# EAGLE design attinier84-motherboard-mk-1.0 (EAGLE 6.5.0)
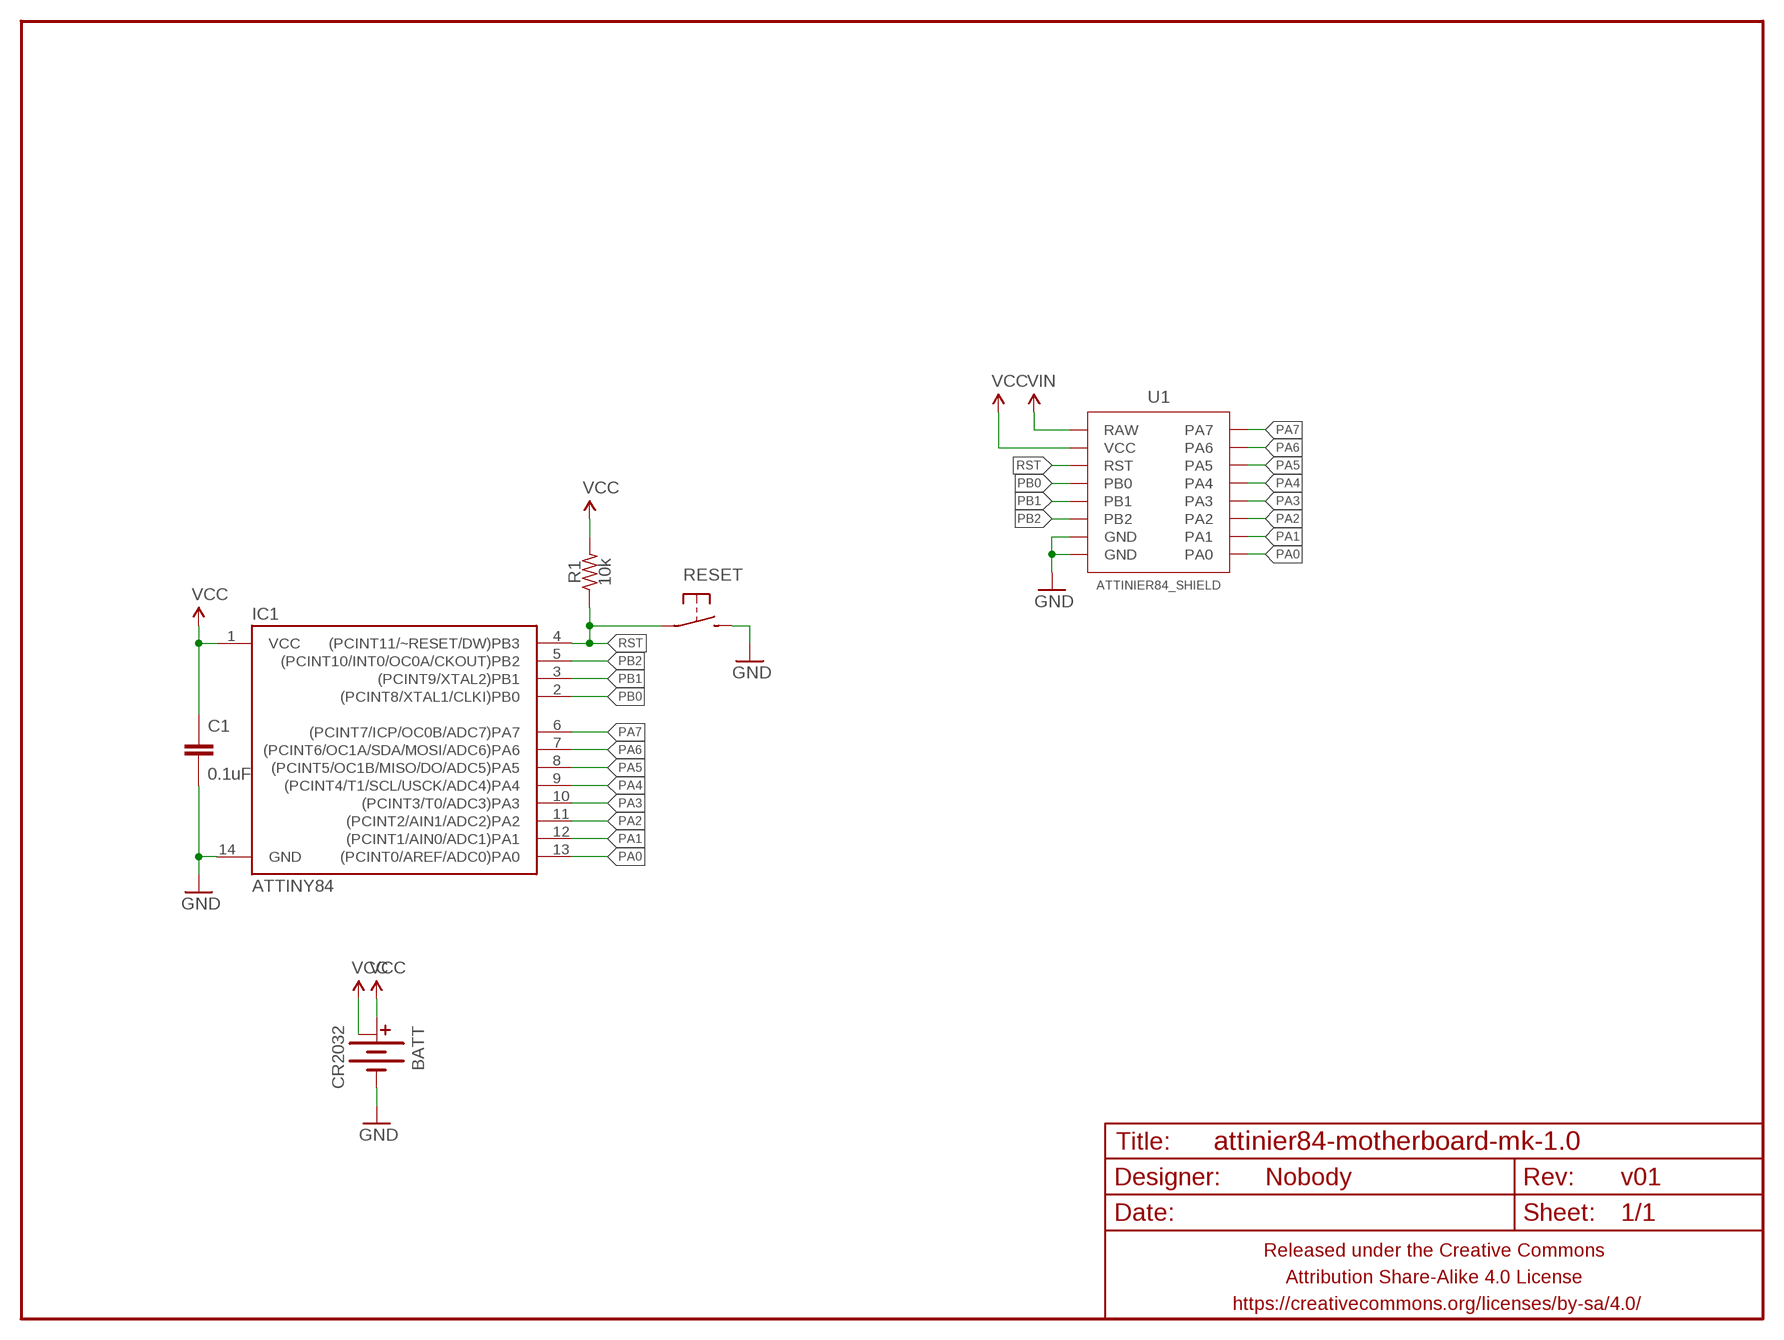
[diagram p0: schematic, sheet 1]

## Parts
BATT  CR2032  BATTERY-COINCR2032_SMD  [BATTCON_20MM_MINE]
C1  0.1uF  CAPACITOR-CERAMICC0805  [C0805]
FRAME1  FRAME-LETTERNO_PACKAGE  [DUMMY]
IC1  ATTINY84  [SO14]
R1  10k  RESISTORR0805  [R0805]
RESET  SPST-NO-TACT6MM-SMD  [DTSM-6]
U1  ATTINIER84_SHIELD  [ATTINIER84_SHIELD]

## Nets
GND: BATT.BOTTOM(-) C1.2 IC1.14(GND) RESET.3 RESET.4 U1.GND@1(GND) U1.GND@2(GND)
PA0: IC1.13((PCINT0/AREF/ADC0)PA0) U1.PA0
PA1: IC1.12((PCINT1/AIN0/ADC1)PA1) U1.PA1
PA2: IC1.11((PCINT2/AIN1/ADC2)PA2) U1.PA2
PA3: IC1.10((PCINT3/T0/ADC3)PA3) U1.PA3
PA4: IC1.9((PCINT4/T1/SCL/USCK/ADC4)PA4) U1.PA4
PA5: IC1.8((PCINT5/OC1B/MISO/DO/ADC5)PA5) U1.PA5
PA6: IC1.7((PCINT6/OC1A/SDA/MOSI/ADC6)PA6) U1.PA6
PA7: IC1.6((PCINT7/ICP/OC0B/ADC7)PA7) U1.PA7
PB0: IC1.2((PCINT8/XTAL1/CLKI)PB0) U1.PB0
PB1: IC1.3((PCINT9/XTAL2)PB1) U1.PB1
PB2: IC1.5((PCINT10/INT0/OC0A/CKOUT)PB2) U1.PB2
RST: IC1.4((PCINT11/~RESET/DW)PB3) R1.1 RESET.1 RESET.2 U1.RST
VCC: BATT.TOP@1(+) BATT.TOP@2(+1) C1.1 IC1.1(VCC) R1.2 U1.VCC
VIN: U1.RAW

## Library data of the parts
BATT = A_butts:BATTERY-COIN
C1 = A_butts:CAPACITOR-CERAMIC: CAPACITOR, European symbol
FRAME1 = A_butts:FRAME-LETTER: Schematic Frame Standard 8.5x11 US Letter frame; DESIGNER: Nobody; VERSION: v01
IC1 = A_butts:ATTINY84: Atmel 14-pin 2/4/8kB flash uC
R1 = A_butts:RESISTOR: RESISTOR, American symbol
RESET = A_butts:SPST-NO-TACT
U1 = A_butts:ATTINIER84_SHIELD

## Board
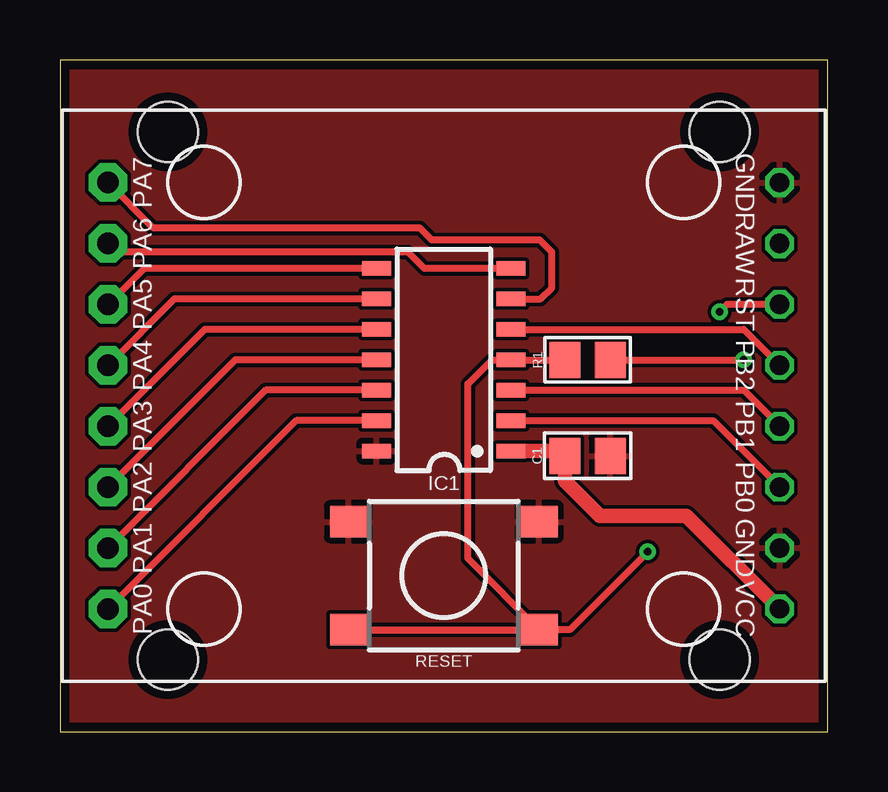
[diagram p1: board, top side]
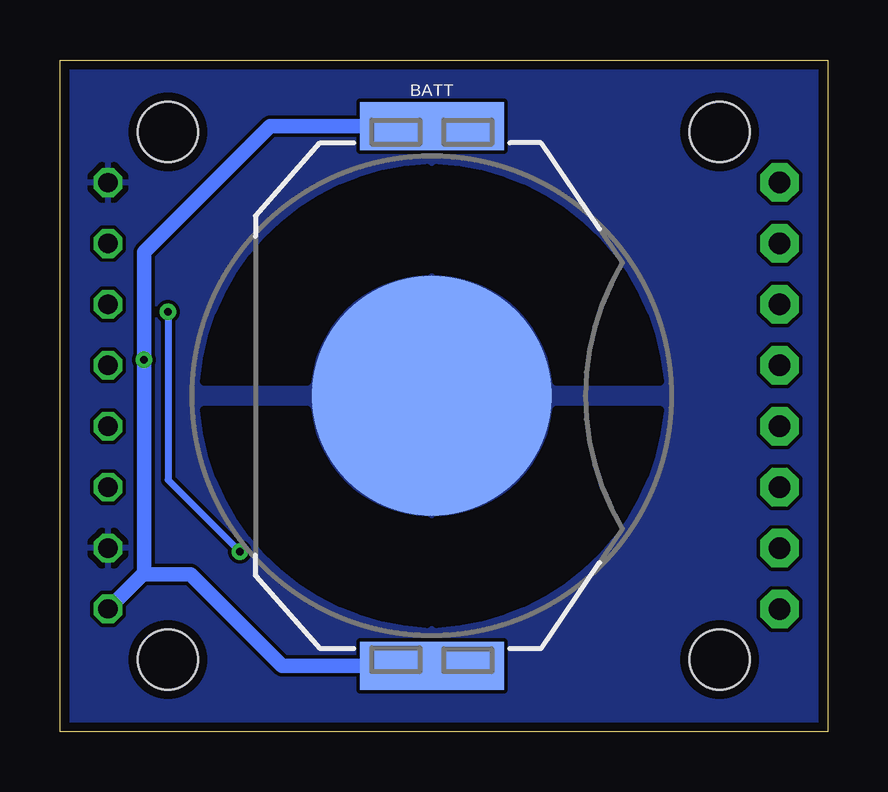
[diagram p2: board, bottom side, seen from below]

Size 32 x 28 mm. Coordinates in mm from the lower left corner, seen from the top.
Outline: 0,0 32,0 32,28 0,28 0,0
Copper layers (1*16): Top 0.0356mm / dielectric 1.5011mm / Bottom 0.0356mm
Design rules "LaenPCBOrder_2": minimum track width 6mil, minimum drill 13mil, track to track 6mil, track to pad 6mil, pad to pad 6mil, via to via 6mil, smd to smd 6mil, copper to edge 15mil, drill to drill 6mil, minimum pad ring 7mil, minimum via ring 7mil, stop-mask expansion 3mil, vias tented up to drill 20mil, thermal gap 10mil
Holes 2.5 mm at 4.5,25 27.5,25 27.5,3 4.5,3

### Footprints (pad centres in the part's own frame; a part is rotated, then mirrored left to right if it is on the bottom)
BATTCON_20MM_MINE = smd 10 x 10: BOTTOM 0,0 | smd 6 x 2: TOP@1 0,11.25; TOP@2 0,-11.25
C0805 = smd 1.3 x 1.5: 1 -0.95,0; 2 0.95,0
SO14 = smd 0.6 x 1.2: 1 -3.81,-2.8; 2 -2.54,-2.8; 3 -1.27,-2.8; 4 0,-2.8; 5 1.27,-2.8; 6 2.54,-2.8; 7 3.81,-2.8; 8 3.81,2.8; 9 2.54,2.8; 10 1.27,2.8; 11 0,2.8; 12 -1.27,2.8; 13 -2.54,2.8; 14 -3.81,2.8
R0805 = smd 1.3 x 1.5: 1 -0.95,0; 2 0.95,0
DTSM-6 = smd 1.55 x 1.3: 1 -3.975,2.25; 2 3.975,2.25; 3 -3.975,-2.25; 4 3.975,-2.25
ATTINIER84_SHIELD = drill 0.8 octagon: GND@1 14,-6.35; GND@2 14,8.89; PB0 14,-3.81; PB1 14,-1.27; PB2 14,1.27; RAW 14,6.35; RST 14,3.81; VCC 14,-8.89 | drill 0.9 pad 1.6 octagon: PA0 -14,-8.89; PA1 -14,-6.35; PA2 -14,-3.81; PA3 -14,-1.27; PA4 -14,1.27; PA5 -14,3.81; PA6 -14,6.35; PA7 -14,8.89

### Placement (x,y rotation side)
BATT  16.5,14 0 bottom
C1  22,11.5 0 top
FRAME1  0,0 0 top
IC1  16,15.5 90 top
R1  22,15.5 0 top
RESET  16,6.5 180 top
U1  16,14 0 top

### Tracks (layer width: path | path; a pad name or v marks a point on that pad's centre or on a via)
GND
  pour Bottom: -0.1,-0.1 -0.1,28.1 32.1,28.1 32.1,-0.1
  pour Top: -0.1,-0.1 -0.1,28.1 32.1,28.1 32.1,-0.1
PA0
  Top 0.3: IC1.13 9.85,12.96 U1.PA0
PA1
  Top 0.3: IC1.12 8.58,14.23 U1.PA1
PA2
  Top 0.3: IC1.11 7.31,15.5 U1.PA2
PA3
  Top 0.3: IC1.10 6.04,16.77 U1.PA3
PA4
  Top 0.3: IC1.9 4.77,18.04 U1.PA4
PA5
  Top 0.3: IC1.8 3.5,19.31 U1.PA5
PA6
  Top 0.3: IC1.7 15.19,19.31 14.5,20 2.35,20 U1.PA6
PA7
  Top 0.3: IC1.6 20.04,18.04 20.5,18.5 20.5,20 20,20.5 15.5,20.5 15,21 3.89,21 U1.PA7
PB0
  Top 0.3: IC1.2 27.23,12.96 U1.PB0
PB1
  Top 0.3: IC1.3 28.5,14.23 U1.PB1
PB2
  Top 0.3: IC1.5 28.5,16.77 U1.PB2
RST  (via drill 0.33)
  Top 0.3: R1.1 IC1.4 18,15.5 17,14.5 17,7.22 RESET.1 | RESET.2 RESET.1 | v24.5,7.5 21.25,4.25 RESET.1 | U1.RST 27.81,17.81 v27.5,17.5
  Bottom 0.3: v27.5,17.5 27.5,10.5 v24.5,7.5
VCC  (via drill 0.33)
  Top 0.3: R1.2 v28.5,15.5
  Top 0.6: IC1.1 20.86,11.69 C1.1 21.05,10.45 22.5,9 26.11,9 U1.VCC
  Bottom 0.6: BATT.TOP@1 23.25,25.25 28.5,20 v28.5,15.5 28.5,6.61 28.55,6.55 | BATT.TOP@2 22.75,2.75 26.55,6.55 28.55,6.55 | 28.55,6.55 U1.VCC